# Altium project ValveBoard - Copy.PrjPcb (part 1 of 2)
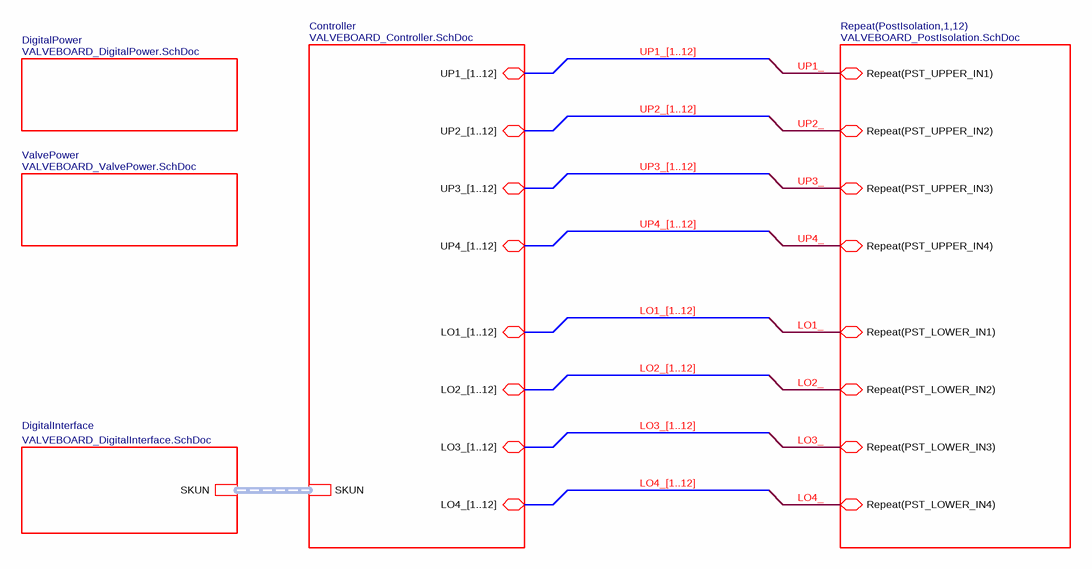
[diagram p0: VALVEBOARD_Top.SchDoc]
9 sheets, 1152 parts. Net scope: hierarchical (ports join the sheet entries above them; power ports are global).
Board file: VALVEBOARD_Kun.PcbDoc
Sheets:
  VALVEBOARD_Top.SchDoc
    PostIsolation1 = VALVEBOARD_PostIsolation.SchDoc
      Isolation = VALVEBOARD_Isolation.SchDoc
      Interface = VALVEBOARD_ValveInterface.SchDoc
      Drive1 = VALVEBOARD_ValveDrive.SchDoc
      Drive2 = VALVEBOARD_ValveDrive.SchDoc
      Drive3 = VALVEBOARD_ValveDrive.SchDoc
      Drive4 = VALVEBOARD_ValveDrive.SchDoc
    PostIsolation2 = VALVEBOARD_PostIsolation.SchDoc
      Isolation = VALVEBOARD_Isolation.SchDoc
      Interface = VALVEBOARD_ValveInterface.SchDoc
      Drive1 = VALVEBOARD_ValveDrive.SchDoc
      Drive2 = VALVEBOARD_ValveDrive.SchDoc
      Drive3 = VALVEBOARD_ValveDrive.SchDoc
      Drive4 = VALVEBOARD_ValveDrive.SchDoc
    PostIsolation3 = VALVEBOARD_PostIsolation.SchDoc
      Isolation = VALVEBOARD_Isolation.SchDoc
      Interface = VALVEBOARD_ValveInterface.SchDoc
      Drive1 = VALVEBOARD_ValveDrive.SchDoc
      Drive2 = VALVEBOARD_ValveDrive.SchDoc
      Drive3 = VALVEBOARD_ValveDrive.SchDoc
      Drive4 = VALVEBOARD_ValveDrive.SchDoc
    PostIsolation4 = VALVEBOARD_PostIsolation.SchDoc
      Isolation = VALVEBOARD_Isolation.SchDoc
      Interface = VALVEBOARD_ValveInterface.SchDoc
      Drive1 = VALVEBOARD_ValveDrive.SchDoc
      Drive2 = VALVEBOARD_ValveDrive.SchDoc
      Drive3 = VALVEBOARD_ValveDrive.SchDoc
      Drive4 = VALVEBOARD_ValveDrive.SchDoc
    PostIsolation5 = VALVEBOARD_PostIsolation.SchDoc
      Isolation = VALVEBOARD_Isolation.SchDoc
      Interface = VALVEBOARD_ValveInterface.SchDoc
      Drive1 = VALVEBOARD_ValveDrive.SchDoc
      Drive2 = VALVEBOARD_ValveDrive.SchDoc
      Drive3 = VALVEBOARD_ValveDrive.SchDoc
      Drive4 = VALVEBOARD_ValveDrive.SchDoc
    PostIsolation6 = VALVEBOARD_PostIsolation.SchDoc
      Isolation = VALVEBOARD_Isolation.SchDoc
      Interface = VALVEBOARD_ValveInterface.SchDoc
      Drive1 = VALVEBOARD_ValveDrive.SchDoc
      Drive2 = VALVEBOARD_ValveDrive.SchDoc
      Drive3 = VALVEBOARD_ValveDrive.SchDoc
      Drive4 = VALVEBOARD_ValveDrive.SchDoc
    PostIsolation7 = VALVEBOARD_PostIsolation.SchDoc
      Isolation = VALVEBOARD_Isolation.SchDoc
      Interface = VALVEBOARD_ValveInterface.SchDoc
      Drive1 = VALVEBOARD_ValveDrive.SchDoc
      Drive2 = VALVEBOARD_ValveDrive.SchDoc
      Drive3 = VALVEBOARD_ValveDrive.SchDoc
      Drive4 = VALVEBOARD_ValveDrive.SchDoc
    PostIsolation8 = VALVEBOARD_PostIsolation.SchDoc
      Isolation = VALVEBOARD_Isolation.SchDoc
      Interface = VALVEBOARD_ValveInterface.SchDoc
      Drive1 = VALVEBOARD_ValveDrive.SchDoc
      Drive2 = VALVEBOARD_ValveDrive.SchDoc
      Drive3 = VALVEBOARD_ValveDrive.SchDoc
      Drive4 = VALVEBOARD_ValveDrive.SchDoc
    PostIsolation9 = VALVEBOARD_PostIsolation.SchDoc
      Isolation = VALVEBOARD_Isolation.SchDoc
      Interface = VALVEBOARD_ValveInterface.SchDoc
      Drive1 = VALVEBOARD_ValveDrive.SchDoc
      Drive2 = VALVEBOARD_ValveDrive.SchDoc
      Drive3 = VALVEBOARD_ValveDrive.SchDoc
      Drive4 = VALVEBOARD_ValveDrive.SchDoc
    PostIsolation10 = VALVEBOARD_PostIsolation.SchDoc
      Isolation = VALVEBOARD_Isolation.SchDoc
      Interface = VALVEBOARD_ValveInterface.SchDoc
      Drive1 = VALVEBOARD_ValveDrive.SchDoc
      Drive2 = VALVEBOARD_ValveDrive.SchDoc
      Drive3 = VALVEBOARD_ValveDrive.SchDoc
      Drive4 = VALVEBOARD_ValveDrive.SchDoc
    PostIsolation11 = VALVEBOARD_PostIsolation.SchDoc
      Isolation = VALVEBOARD_Isolation.SchDoc
      Interface = VALVEBOARD_ValveInterface.SchDoc
      Drive1 = VALVEBOARD_ValveDrive.SchDoc
      Drive2 = VALVEBOARD_ValveDrive.SchDoc
      Drive3 = VALVEBOARD_ValveDrive.SchDoc
      Drive4 = VALVEBOARD_ValveDrive.SchDoc
    PostIsolation12 = VALVEBOARD_PostIsolation.SchDoc
      Isolation = VALVEBOARD_Isolation.SchDoc
      Interface = VALVEBOARD_ValveInterface.SchDoc
      Drive1 = VALVEBOARD_ValveDrive.SchDoc
      Drive2 = VALVEBOARD_ValveDrive.SchDoc
      Drive3 = VALVEBOARD_ValveDrive.SchDoc
      Drive4 = VALVEBOARD_ValveDrive.SchDoc
    Controller = VALVEBOARD_Controller.SchDoc
    DigitalInterface = VALVEBOARD_DigitalInterface.SchDoc
    DigitalPower = VALVEBOARD_DigitalPower.SchDoc
    ValvePower = VALVEBOARD_ValvePower.SchDoc

## Sheet VALVEBOARD_Top.SchDoc
size A4; SheetNumber: 1; SheetTotal: 9

### Sub-sheets
Controller = VALVEBOARD_Controller.SchDoc: UP1_[1..12] (bidir), UP2_[1..12] (bidir), UP3_[1..12] (bidir), UP4_[1..12] (bidir), LO1_[1..12] (bidir), LO2_[1..12] (bidir), LO3_[1..12] (bidir), LO4_[1..12] (bidir), SKUN
DigitalInterface = VALVEBOARD_DigitalInterface.SchDoc: SKUN (harness SKUN_TYPE)
DigitalPower = VALVEBOARD_DigitalPower.SchDoc: no entries
Repeat(PostIsolation,1,12) = VALVEBOARD_PostIsolation.SchDoc: Repeat(PST_UPPER_IN1) (bidir), Repeat(PST_UPPER_IN2) (bidir), Repeat(PST_UPPER_IN3) (bidir), Repeat(PST_UPPER_IN4) (bidir), Repeat(PST_LOWER_IN1) (bidir), Repeat(PST_LOWER_IN2) (bidir), Repeat(PST_LOWER_IN3) (bidir), Repeat(PST_LOWER_IN4) (bidir)
ValvePower = VALVEBOARD_ValvePower.SchDoc: no entries

### Buses and harness runs
bus LO1_[1..12] = sheet Controller/LO1_[1..12]
bus LO2_[1..12] = sheet Controller/LO2_[1..12]
bus LO3_[1..12] = sheet Controller/LO3_[1..12]
bus LO4_[1..12] = sheet Controller/LO4_[1..12]
bus UP1_[1..12] = sheet Controller/UP1_[1..12]
bus UP2_[1..12] = sheet Controller/UP2_[1..12]
bus UP3_[1..12] = sheet Controller/UP3_[1..12]
bus UP4_[1..12] = sheet Controller/UP4_[1..12]
harness sheet Controller/SKUN = sheet DigitalInterface/SKUN

## Sheet VALVEBOARD_PostIsolation.SchDoc
size A4; SheetNumber: 5; SheetTotal: 8
Used 12 times, as channels PostIsolation1, PostIsolation2, PostIsolation3, PostIsolation4, PostIsolation5, PostIsolation6, PostIsolation7, PostIsolation8, PostIsolation9, PostIsolation10, PostIsolation11, PostIsolation12. Parts and nets are listed once, with the designators drawn on the sheet.
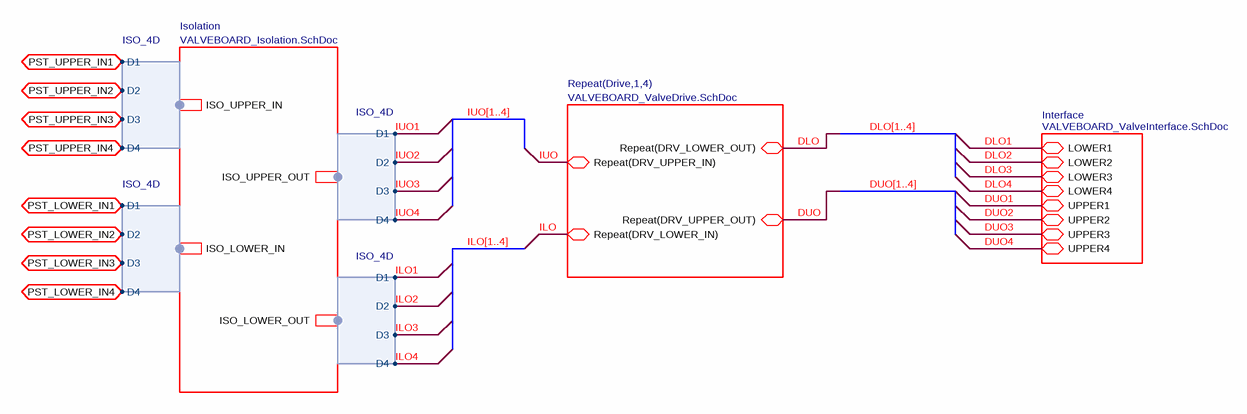
[diagram p1: VALVEBOARD_PostIsolation.SchDoc]

### Sub-sheets
Interface = VALVEBOARD_ValveInterface.SchDoc: LOWER1 (bidir), LOWER2 (bidir), LOWER3 (bidir), LOWER4 (bidir), UPPER1 (bidir), UPPER2 (bidir), UPPER3 (bidir), UPPER4 (bidir)
Isolation = VALVEBOARD_Isolation.SchDoc: ISO_UPPER_IN (harness ISO_4D), ISO_UPPER_OUT (harness ISO_4D), ISO_LOWER_IN (harness ISO_4D), ISO_LOWER_OUT (harness ISO_4D)
Repeat(Drive,1,4) = VALVEBOARD_ValveDrive.SchDoc: Repeat(DRV_UPPER_IN) (bidir), Repeat(DRV_LOWER_IN) (bidir), Repeat(DRV_UPPER_OUT) (bidir), Repeat(DRV_LOWER_OUT) (bidir)

### Ports
PST_LOWER_IN1 (bidir), PST_LOWER_IN2 (bidir), PST_LOWER_IN3 (bidir), PST_LOWER_IN4 (bidir), PST_UPPER_IN1 (bidir), PST_UPPER_IN2 (bidir), PST_UPPER_IN3 (bidir), PST_UPPER_IN4 (bidir)

### Harnesses
ISO_4D: D1, D2, D3, D4

### Nets
DLO: sheet Repeat(Drive,1,4)/Repeat(DRV_LOWER_OUT)
DLO1: sheet Interface/LOWER1
DLO2: sheet Interface/LOWER2
DLO3: sheet Interface/LOWER3
DLO4: sheet Interface/LOWER4
DUO: sheet Repeat(Drive,1,4)/Repeat(DRV_UPPER_OUT)
DUO1: sheet Interface/UPPER1
DUO2: sheet Interface/UPPER2
DUO3: sheet Interface/UPPER3
DUO4: sheet Interface/UPPER4
ILO: sheet Repeat(Drive,1,4)/Repeat(DRV_LOWER_IN)
ILO1: sheet Isolation/ISO_LOWER_OUT.D1
ILO2: sheet Isolation/ISO_LOWER_OUT.D2
ILO3: sheet Isolation/ISO_LOWER_OUT.D3
ILO4: sheet Isolation/ISO_LOWER_OUT.D4
IUO: sheet Repeat(Drive,1,4)/Repeat(DRV_UPPER_IN)
IUO1: sheet Isolation/ISO_UPPER_OUT.D1
IUO2: sheet Isolation/ISO_UPPER_OUT.D2
IUO3: sheet Isolation/ISO_UPPER_OUT.D3
IUO4: sheet Isolation/ISO_UPPER_OUT.D4
PST_LOWER_IN1: port PST_LOWER_IN1, sheet Isolation/ISO_LOWER_IN.D1
PST_LOWER_IN2: port PST_LOWER_IN2, sheet Isolation/ISO_LOWER_IN.D2
PST_LOWER_IN3: port PST_LOWER_IN3, sheet Isolation/ISO_LOWER_IN.D3
PST_LOWER_IN4: port PST_LOWER_IN4, sheet Isolation/ISO_LOWER_IN.D4
PST_UPPER_IN1: port PST_UPPER_IN1, sheet Isolation/ISO_UPPER_IN.D1
PST_UPPER_IN2: port PST_UPPER_IN2, sheet Isolation/ISO_UPPER_IN.D2
PST_UPPER_IN3: port PST_UPPER_IN3, sheet Isolation/ISO_UPPER_IN.D3
PST_UPPER_IN4: port PST_UPPER_IN4, sheet Isolation/ISO_UPPER_IN.D4

### Channels
PostIsolation1: ports PST_LOWER_IN1=LO1_1 PST_LOWER_IN2=LO2_1 PST_LOWER_IN3=LO3_1 PST_LOWER_IN4=LO4_1 PST_UPPER_IN1=UP1_1 PST_UPPER_IN2=UP2_1 PST_UPPER_IN3=UP3_1 PST_UPPER_IN4=UP4_1
PostIsolation2: ports PST_LOWER_IN1=LO1_2 PST_LOWER_IN2=LO2_2 PST_LOWER_IN3=LO3_2 PST_LOWER_IN4=LO4_2 PST_UPPER_IN1=UP1_2 PST_UPPER_IN2=UP2_2 PST_UPPER_IN3=UP3_2 PST_UPPER_IN4=UP4_2
PostIsolation3: ports PST_LOWER_IN1=LO1_3 PST_LOWER_IN2=LO2_3 PST_LOWER_IN3=LO3_3 PST_LOWER_IN4=LO4_3 PST_UPPER_IN1=UP1_3 PST_UPPER_IN2=UP2_3 PST_UPPER_IN3=UP3_3 PST_UPPER_IN4=UP4_3
PostIsolation4: ports PST_LOWER_IN1=LO1_4 PST_LOWER_IN2=LO2_4 PST_LOWER_IN3=LO3_4 PST_LOWER_IN4=LO4_4 PST_UPPER_IN1=UP1_4 PST_UPPER_IN2=UP2_4 PST_UPPER_IN3=UP3_4 PST_UPPER_IN4=UP4_4
PostIsolation5: ports PST_LOWER_IN1=LO1_5 PST_LOWER_IN2=LO2_5 PST_LOWER_IN3=LO3_5 PST_LOWER_IN4=LO4_5 PST_UPPER_IN1=UP1_5 PST_UPPER_IN2=UP2_5 PST_UPPER_IN3=UP3_5 PST_UPPER_IN4=UP4_5
PostIsolation6: ports PST_LOWER_IN1=LO1_6 PST_LOWER_IN2=LO2_6 PST_LOWER_IN3=LO3_6 PST_LOWER_IN4=LO4_6 PST_UPPER_IN1=UP1_6 PST_UPPER_IN2=UP2_6 PST_UPPER_IN3=UP3_6 PST_UPPER_IN4=UP4_6
PostIsolation7: ports PST_LOWER_IN1=LO1_7 PST_LOWER_IN2=LO2_7 PST_LOWER_IN3=LO3_7 PST_LOWER_IN4=LO4_7 PST_UPPER_IN1=UP1_7 PST_UPPER_IN2=UP2_7 PST_UPPER_IN3=UP3_7 PST_UPPER_IN4=UP4_7
PostIsolation8: ports PST_LOWER_IN1=LO1_8 PST_LOWER_IN2=LO2_8 PST_LOWER_IN3=LO3_8 PST_LOWER_IN4=LO4_8 PST_UPPER_IN1=UP1_8 PST_UPPER_IN2=UP2_8 PST_UPPER_IN3=UP3_8 PST_UPPER_IN4=UP4_8
PostIsolation9: ports PST_LOWER_IN1=LO1_9 PST_LOWER_IN2=LO2_9 PST_LOWER_IN3=LO3_9 PST_LOWER_IN4=LO4_9 PST_UPPER_IN1=UP1_9 PST_UPPER_IN2=UP2_9 PST_UPPER_IN3=UP3_9 PST_UPPER_IN4=UP4_9
PostIsolation10: ports PST_LOWER_IN1=LO1_10 PST_LOWER_IN2=LO2_10 PST_LOWER_IN3=LO3_10 PST_LOWER_IN4=LO4_10 PST_UPPER_IN1=UP1_10 PST_UPPER_IN2=UP2_10 PST_UPPER_IN3=UP3_10 PST_UPPER_IN4=UP4_10
PostIsolation11: ports PST_LOWER_IN1=LO1_11 PST_LOWER_IN2=LO2_11 PST_LOWER_IN3=LO3_11 PST_LOWER_IN4=LO4_11 PST_UPPER_IN1=UP1_11 PST_UPPER_IN2=UP2_11 PST_UPPER_IN3=UP3_11 PST_UPPER_IN4=UP4_11
PostIsolation12: ports PST_LOWER_IN1=LO1_12 PST_LOWER_IN2=LO2_12 PST_LOWER_IN3=LO3_12 PST_LOWER_IN4=LO4_12 PST_UPPER_IN1=UP1_12 PST_UPPER_IN2=UP2_12 PST_UPPER_IN3=UP3_12 PST_UPPER_IN4=UP4_12

### Buses and harness runs
bus DLO[1..4]
bus DUO[1..4]
bus ILO[1..4]
bus IUO[1..4]

## Sheet VALVEBOARD_Isolation.SchDoc
size A4; SheetNumber: 6; SheetTotal: 9
Used 12 times, as channels PostIsolation1/Isolation, PostIsolation2/Isolation, PostIsolation3/Isolation, PostIsolation4/Isolation, PostIsolation5/Isolation, PostIsolation6/Isolation, PostIsolation7/Isolation, PostIsolation8/Isolation, PostIsolation9/Isolation, PostIsolation10/Isolation, PostIsolation11/Isolation, PostIsolation12/Isolation. Parts and nets are listed once, with the designators drawn on the sheet.
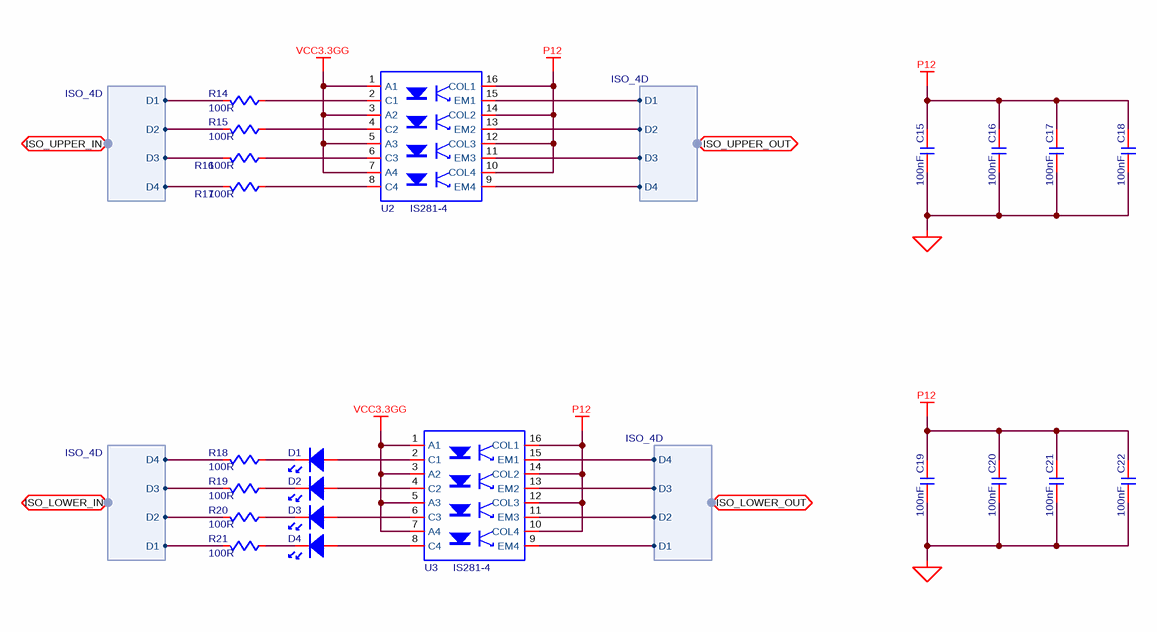
[diagram p2: VALVEBOARD_Isolation.SchDoc]

### Parts
C15  value 100nF  [C0603]  (hidden comment: C-NOMO)
C16  value 100nF  [C0603]  (hidden comment: C-NOMO)
C17  value 100nF  [C0603]  (hidden comment: C-NOMO)
C18  value 100nF  [C0603]  (hidden comment: C-NOMO)
C19  value 100nF  [C0603]  (hidden comment: C-NOMO)
C20  value 100nF  [C0603]  (hidden comment: C-NOMO)
C21  value 100nF  [C0603]  (hidden comment: C-NOMO)
C22  value 100nF  [C0603]  (hidden comment: C-NOMO)
D1  LED  [LED0603]  (value not drawn)
D2  LED  [LED0603]  (value not drawn)
D3  LED  [LED0603]  (value not drawn)
D4  LED  [LED0603]  (value not drawn)
R14  value 100R  [R0603]  (hidden comment: R)
R15  value 100R  [R0603]  (hidden comment: R)
R16  value 100R  [R0603]  (hidden comment: R)
R17  value 100R  [R0603]  (hidden comment: R)
R18  value 100R  [R0603]  (hidden comment: R)
R19  value 100R  [R0603]  (hidden comment: R)
R20  value 100R  [R0603]  (hidden comment: R)
R21  value 100R  [R0603]  (hidden comment: R)
U2  IS281-4  [PS2801]
U3  IS281-4  [PS2801]

### Ports
ISO_LOWER_IN (bidir, harness ISO_4D), ISO_LOWER_OUT (bidir, harness ISO_4D), ISO_UPPER_IN (bidir, harness ISO_4D), ISO_UPPER_OUT (bidir, harness ISO_4D)

### Harnesses
ISO_4D: D1, D2, D3, D4
ISO_4D: D4, D3, D2, D1

### Nets
P12: C15.2 C16.2 C17.2 C18.2 C19.2 C20.2 C21.2 C22.2 U2.10(COL4) U2.12(COL3) U2.14(COL2) U2.16(COL1) U3.10(COL4) U3.12(COL3) U3.14(COL2) U3.16(COL1)
PGND: C15.1 C16.1 C17.1 C18.1 C19.1 C20.1 C21.1 C22.1
VCC3.3GG: U2.1(A1) U2.3(A2) U2.5(A3) U2.7(A4) U3.1(A1) U3.3(A2) U3.5(A3) U3.7(A4)
NetD1_1: D1.1 R18.2
NetD1_2: D1.2 U3.2(C1)
NetD2_1: D2.1 R19.2
NetD2_2: D2.2 U3.4(C2)
NetD3_1: D3.1 R20.2
NetD3_2: D3.2 U3.6(C3)
NetD4_1: D4.1 R21.2
NetD4_2: D4.2 U3.8(C4)
NetR14_1: R14.1 ; port ISO_UPPER_IN.D1
NetR14_2: R14.2 U2.2(C1)
NetR15_1: R15.1 ; port ISO_UPPER_IN.D2
NetR15_2: R15.2 U2.4(C2)
NetR16_1: R16.1 ; port ISO_UPPER_IN.D3
NetR16_2: R16.2 U2.6(C3)
NetR17_1: R17.1 ; port ISO_UPPER_IN.D4
NetR17_2: R17.2 U2.8(C4)
NetR18_1: R18.1 ; port ISO_LOWER_IN.D4
NetR19_1: R19.1 ; port ISO_LOWER_IN.D3
NetR20_1: R20.1 ; port ISO_LOWER_IN.D2
NetR21_1: R21.1 ; port ISO_LOWER_IN.D1
NetU2_9: U2.9(EM4) ; port ISO_UPPER_OUT.D4
NetU2_11: U2.11(EM3) ; port ISO_UPPER_OUT.D3
NetU2_13: U2.13(EM2) ; port ISO_UPPER_OUT.D2
NetU2_15: U2.15(EM1) ; port ISO_UPPER_OUT.D1
NetU3_9: U3.9(EM4) ; port ISO_LOWER_OUT.D1
NetU3_11: U3.11(EM3) ; port ISO_LOWER_OUT.D2
NetU3_13: U3.13(EM2) ; port ISO_LOWER_OUT.D3
NetU3_15: U3.15(EM1) ; port ISO_LOWER_OUT.D4

### Channels
PostIsolation1/Isolation: designators end in _PostIsolation1_Isolation
PostIsolation2/Isolation: designators end in _PostIsolation2_Isolation
PostIsolation3/Isolation: designators end in _PostIsolation3_Isolation
PostIsolation4/Isolation: designators end in _PostIsolation4_Isolation
PostIsolation5/Isolation: designators end in _PostIsolation5_Isolation
PostIsolation6/Isolation: designators end in _PostIsolation6_Isolation
PostIsolation7/Isolation: designators end in _PostIsolation7_Isolation
PostIsolation8/Isolation: designators end in _PostIsolation8_Isolation
PostIsolation9/Isolation: designators end in _PostIsolation9_Isolation
PostIsolation10/Isolation: designators end in _PostIsolation10_Isolation
PostIsolation11/Isolation: designators end in _PostIsolation11_Isolation
PostIsolation12/Isolation: designators end in _PostIsolation12_Isolation

### Library data of the parts
C15-C22 = C-NOMO: voltage: 25V; precision: 5%
R14-R21 = R: precision: 1%
U2 U3 = PS2801

## Sheet VALVEBOARD_ValveInterface.SchDoc
size A4; SheetNumber: 7; SheetTotal: 9
Used 12 times, as channels PostIsolation1/Interface, PostIsolation2/Interface, PostIsolation3/Interface, PostIsolation4/Interface, PostIsolation5/Interface, PostIsolation6/Interface, PostIsolation7/Interface, PostIsolation8/Interface, PostIsolation9/Interface, PostIsolation10/Interface, PostIsolation11/Interface, PostIsolation12/Interface. Parts and nets are listed once, with the designators drawn on the sheet.
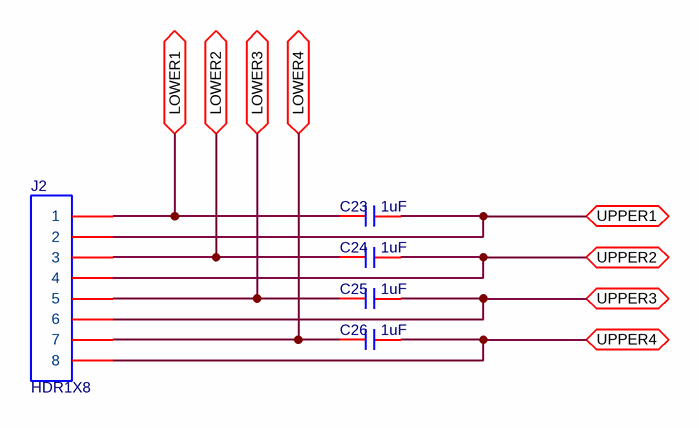
[diagram p3: VALVEBOARD_ValveInterface.SchDoc]

### Parts
C23  value 1uF  [C0805]  (hidden comment: C-NOMO)
C24  value 1uF  [C0805]  (hidden comment: C-NOMO)
C25  value 1uF  [C0805]  (hidden comment: C-NOMO)
C26  value 1uF  [C0805]  (hidden comment: C-NOMO)
J2  HDR1X8  [KF15EDGK-3.81-8P]

### Ports
LOWER1 (bidir), LOWER2 (bidir), LOWER3 (bidir), LOWER4 (bidir), UPPER1 (bidir), UPPER2 (bidir), UPPER3 (bidir), UPPER4 (bidir)

### Nets
LOWER1: C23.2 J2.1 ; port LOWER1
LOWER2: C24.2 J2.3 ; port LOWER2
LOWER3: C25.2 J2.5 ; port LOWER3
LOWER4: C26.2 J2.7 ; port LOWER4
UPPER1: C23.1 J2.2 ; port UPPER1
UPPER2: C24.1 J2.4 ; port UPPER2
UPPER3: C25.1 J2.6 ; port UPPER3
UPPER4: C26.1 J2.8 ; port UPPER4

### Channels
PostIsolation1/Interface: designators end in _PostIsolation1_Interface; ports LOWER1=DLO1_PostIsolation1 LOWER2=DLO2_PostIsolation1 LOWER3=DLO3_PostIsolation1 LOWER4=DLO4_PostIsolation1 UPPER1=DUO1_PostIsolation1 UPPER2=DUO2_PostIsolation1 UPPER3=DUO3_PostIsolation1 UPPER4=DUO4_PostIsolation1
PostIsolation2/Interface: designators end in _PostIsolation2_Interface; ports LOWER1=DLO1_PostIsolation2 LOWER2=DLO2_PostIsolation2 LOWER3=DLO3_PostIsolation2 LOWER4=DLO4_PostIsolation2 UPPER1=DUO1_PostIsolation2 UPPER2=DUO2_PostIsolation2 UPPER3=DUO3_PostIsolation2 UPPER4=DUO4_PostIsolation2
PostIsolation3/Interface: designators end in _PostIsolation3_Interface; ports LOWER1=DLO1_PostIsolation3 LOWER2=DLO2_PostIsolation3 LOWER3=DLO3_PostIsolation3 LOWER4=DLO4_PostIsolation3 UPPER1=DUO1_PostIsolation3 UPPER2=DUO2_PostIsolation3 UPPER3=DUO3_PostIsolation3 UPPER4=DUO4_PostIsolation3
PostIsolation4/Interface: designators end in _PostIsolation4_Interface; ports LOWER1=DLO1_PostIsolation4 LOWER2=DLO2_PostIsolation4 LOWER3=DLO3_PostIsolation4 LOWER4=DLO4_PostIsolation4 UPPER1=DUO1_PostIsolation4 UPPER2=DUO2_PostIsolation4 UPPER3=DUO3_PostIsolation4 UPPER4=DUO4_PostIsolation4
PostIsolation5/Interface: designators end in _PostIsolation5_Interface; ports LOWER1=DLO1_PostIsolation5 LOWER2=DLO2_PostIsolation5 LOWER3=DLO3_PostIsolation5 LOWER4=DLO4_PostIsolation5 UPPER1=DUO1_PostIsolation5 UPPER2=DUO2_PostIsolation5 UPPER3=DUO3_PostIsolation5 UPPER4=DUO4_PostIsolation5
PostIsolation6/Interface: designators end in _PostIsolation6_Interface; ports LOWER1=DLO1_PostIsolation6 LOWER2=DLO2_PostIsolation6 LOWER3=DLO3_PostIsolation6 LOWER4=DLO4_PostIsolation6 UPPER1=DUO1_PostIsolation6 UPPER2=DUO2_PostIsolation6 UPPER3=DUO3_PostIsolation6 UPPER4=DUO4_PostIsolation6
PostIsolation7/Interface: designators end in _PostIsolation7_Interface; ports LOWER1=DLO1_PostIsolation7 LOWER2=DLO2_PostIsolation7 LOWER3=DLO3_PostIsolation7 LOWER4=DLO4_PostIsolation7 UPPER1=DUO1_PostIsolation7 UPPER2=DUO2_PostIsolation7 UPPER3=DUO3_PostIsolation7 UPPER4=DUO4_PostIsolation7
PostIsolation8/Interface: designators end in _PostIsolation8_Interface; ports LOWER1=DLO1_PostIsolation8 LOWER2=DLO2_PostIsolation8 LOWER3=DLO3_PostIsolation8 LOWER4=DLO4_PostIsolation8 UPPER1=DUO1_PostIsolation8 UPPER2=DUO2_PostIsolation8 UPPER3=DUO3_PostIsolation8 UPPER4=DUO4_PostIsolation8
PostIsolation9/Interface: designators end in _PostIsolation9_Interface; ports LOWER1=DLO1_PostIsolation9 LOWER2=DLO2_PostIsolation9 LOWER3=DLO3_PostIsolation9 LOWER4=DLO4_PostIsolation9 UPPER1=DUO1_PostIsolation9 UPPER2=DUO2_PostIsolation9 UPPER3=DUO3_PostIsolation9 UPPER4=DUO4_PostIsolation9
PostIsolation10/Interface: designators end in _PostIsolation10_Interface; ports LOWER1=DLO1_PostIsolation10 LOWER2=DLO2_PostIsolation10 LOWER3=DLO3_PostIsolation10 LOWER4=DLO4_PostIsolation10 UPPER1=DUO1_PostIsolation10 UPPER2=DUO2_PostIsolation10 UPPER3=DUO3_PostIsolation10 UPPER4=DUO4_PostIsolation10
PostIsolation11/Interface: designators end in _PostIsolation11_Interface; ports LOWER1=DLO1_PostIsolation11 LOWER2=DLO2_PostIsolation11 LOWER3=DLO3_PostIsolation11 LOWER4=DLO4_PostIsolation11 UPPER1=DUO1_PostIsolation11 UPPER2=DUO2_PostIsolation11 UPPER3=DUO3_PostIsolation11 UPPER4=DUO4_PostIsolation11
PostIsolation12/Interface: designators end in _PostIsolation12_Interface; ports LOWER1=DLO1_PostIsolation12 LOWER2=DLO2_PostIsolation12 LOWER3=DLO3_PostIsolation12 LOWER4=DLO4_PostIsolation12 UPPER1=DUO1_PostIsolation12 UPPER2=DUO2_PostIsolation12 UPPER3=DUO3_PostIsolation12 UPPER4=DUO4_PostIsolation12

### Library data of the parts
C23-C26 = C-NOMO: voltage: 25V; precision: 5%

## Sheet VALVEBOARD_ValveDrive.SchDoc
size A4; SheetNumber: 8; SheetTotal: 9
Used 48 times, as channels PostIsolation1/Drive1, PostIsolation1/Drive2, PostIsolation1/Drive3, PostIsolation1/Drive4, PostIsolation2/Drive1, PostIsolation2/Drive2, PostIsolation2/Drive3, PostIsolation2/Drive4, PostIsolation3/Drive1, PostIsolation3/Drive2, PostIsolation3/Drive3, PostIsolation3/Drive4, PostIsolation4/Drive1, PostIsolation4/Drive2, PostIsolation4/Drive3, PostIsolation4/Drive4, PostIsolation5/Drive1, PostIsolation5/Drive2, PostIsolation5/Drive3, PostIsolation5/Drive4, PostIsolation6/Drive1, PostIsolation6/Drive2, PostIsolation6/Drive3, PostIsolation6/Drive4, PostIsolation7/Drive1, PostIsolation7/Drive2, PostIsolation7/Drive3, PostIsolation7/Drive4, PostIsolation8/Drive1, PostIsolation8/Drive2, PostIsolation8/Drive3, PostIsolation8/Drive4, PostIsolation9/Drive1, PostIsolation9/Drive2, PostIsolation9/Drive3, PostIsolation9/Drive4, PostIsolation10/Drive1, PostIsolation10/Drive2, PostIsolation10/Drive3, PostIsolation10/Drive4, PostIsolation11/Drive1, PostIsolation11/Drive2, PostIsolation11/Drive3, PostIsolation11/Drive4, PostIsolation12/Drive1, PostIsolation12/Drive2, PostIsolation12/Drive3, PostIsolation12/Drive4. Parts and nets are listed once, with the designators drawn on the sheet.
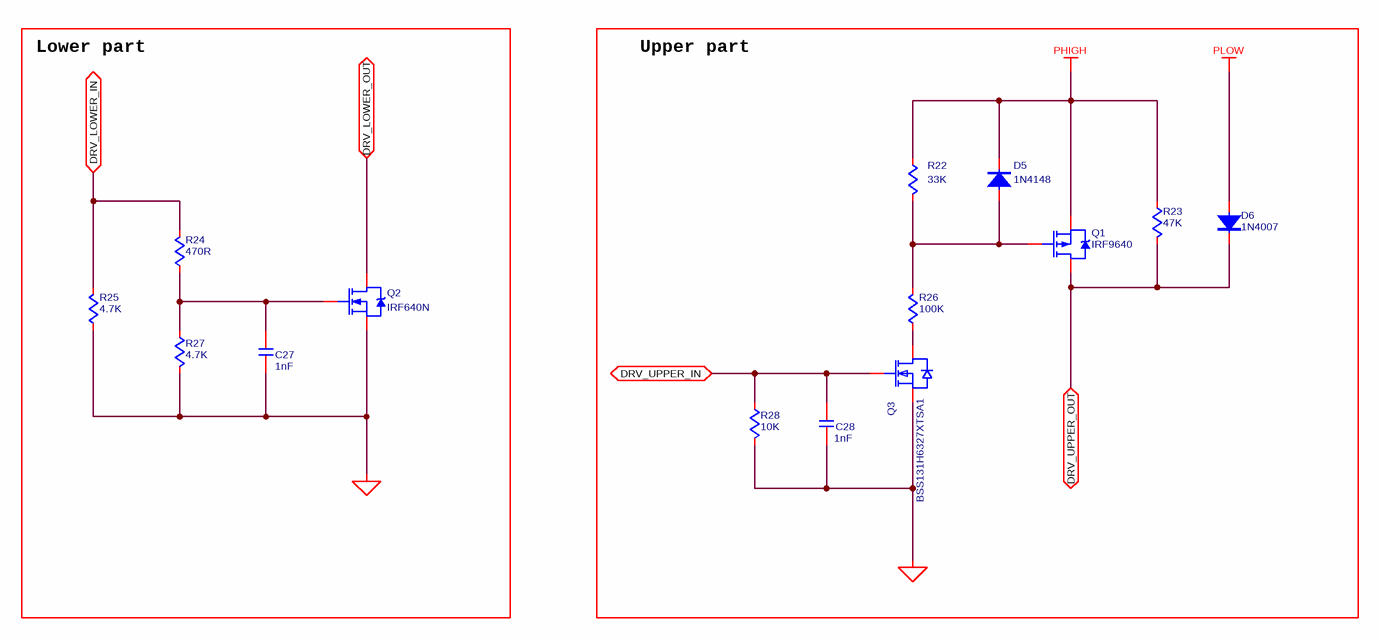
[diagram p4: VALVEBOARD_ValveDrive.SchDoc]

### Parts
C27  value 1nF  [C0603]  (hidden comment: C-NOMO)
C28  value 1nF  [C0603]  (hidden comment: C-NOMO)
D5  1N4148  [sod-123]
D6  1N4007  [1N4148]
Q1  IRF9640  [TO-220AB]
Q2  IRF640N  [TO-220AB]
Q3  BSS131H6327XTSA1  [BSS131H6327XTSA1]
R22  value 33K  [R0805]  (hidden comment: R)
R23  value 47K  [R2512]  (hidden comment: R)
R24  value 470R  [R0603]  (hidden comment: R)
R25  value 4.7K  [R0603]  (hidden comment: R)
R26  value 100K  [R0805]  (hidden comment: R)
R27  value 4.7K  [R0603]  (hidden comment: R)
R28  value 10K  [R0603]  (hidden comment: R)

### Blocks framed on the sheet
Lower part: C27 Q2 R24 R25 R27
Upper part: C28 D5 D6 Q1 Q3 R22 R23 R26 R28

### Ports
DRV_LOWER_IN (bidir), DRV_LOWER_OUT (bidir), DRV_UPPER_IN (bidir), DRV_UPPER_OUT (bidir)

### Nets
PGND: C27.1 C28.1 Q2.3(S) Q3.S R25.2 R27.1 R28.1
PHIGH: D5.1 Q1.3(S) R22.2 R23.2
PLOW: D6.2
DRV_LOWER_IN: R24.1 R25.1 ; port DRV_LOWER_IN
DRV_LOWER_OUT: Q2.2(D) ; port DRV_LOWER_OUT
DRV_UPPER_IN: C28.2 Q3.G R28.2 ; port DRV_UPPER_IN
DRV_UPPER_OUT: D6.1 Q1.2(D) R23.1 ; port DRV_UPPER_OUT
NetC27_2: C27.2 Q2.1(G) R24.2 R27.2
NetD5_2: D5.2 Q1.1(G) R22.1 R26.1
NetQ3_D: Q3.D R26.2

### Channels
PostIsolation1/Drive1: designators end in _PostIsolation1_Drive1; ports DRV_LOWER_IN=ILO1_PostIsolation1 DRV_LOWER_OUT=DLO1_PostIsolation1 DRV_UPPER_IN=IUO1_PostIsolation1 DRV_UPPER_OUT=DUO1_PostIsolation1
PostIsolation1/Drive2: designators end in _PostIsolation1_Drive2; ports DRV_LOWER_IN=ILO2_PostIsolation1 DRV_LOWER_OUT=DLO2_PostIsolation1 DRV_UPPER_IN=IUO2_PostIsolation1 DRV_UPPER_OUT=DUO2_PostIsolation1
PostIsolation1/Drive3: designators end in _PostIsolation1_Drive3; ports DRV_LOWER_IN=ILO3_PostIsolation1 DRV_LOWER_OUT=DLO3_PostIsolation1 DRV_UPPER_IN=IUO3_PostIsolation1 DRV_UPPER_OUT=DUO3_PostIsolation1
PostIsolation1/Drive4: designators end in _PostIsolation1_Drive4; ports DRV_LOWER_IN=ILO4_PostIsolation1 DRV_LOWER_OUT=DLO4_PostIsolation1 DRV_UPPER_IN=IUO4_PostIsolation1 DRV_UPPER_OUT=DUO4_PostIsolation1
PostIsolation2/Drive1: designators end in _PostIsolation2_Drive1; ports DRV_LOWER_IN=ILO1_PostIsolation2 DRV_LOWER_OUT=DLO1_PostIsolation2 DRV_UPPER_IN=IUO1_PostIsolation2 DRV_UPPER_OUT=DUO1_PostIsolation2
PostIsolation2/Drive2: designators end in _PostIsolation2_Drive2; ports DRV_LOWER_IN=ILO2_PostIsolation2 DRV_LOWER_OUT=DLO2_PostIsolation2 DRV_UPPER_IN=IUO2_PostIsolation2 DRV_UPPER_OUT=DUO2_PostIsolation2
PostIsolation2/Drive3: designators end in _PostIsolation2_Drive3; ports DRV_LOWER_IN=ILO3_PostIsolation2 DRV_LOWER_OUT=DLO3_PostIsolation2 DRV_UPPER_IN=IUO3_PostIsolation2 DRV_UPPER_OUT=DUO3_PostIsolation2
PostIsolation2/Drive4: designators end in _PostIsolation2_Drive4; ports DRV_LOWER_IN=ILO4_PostIsolation2 DRV_LOWER_OUT=DLO4_PostIsolation2 DRV_UPPER_IN=IUO4_PostIsolation2 DRV_UPPER_OUT=DUO4_PostIsolation2
PostIsolation3/Drive1: designators end in _PostIsolation3_Drive1; ports DRV_LOWER_IN=ILO1_PostIsolation3 DRV_LOWER_OUT=DLO1_PostIsolation3 DRV_UPPER_IN=IUO1_PostIsolation3 DRV_UPPER_OUT=DUO1_PostIsolation3
PostIsolation3/Drive2: designators end in _PostIsolation3_Drive2; ports DRV_LOWER_IN=ILO2_PostIsolation3 DRV_LOWER_OUT=DLO2_PostIsolation3 DRV_UPPER_IN=IUO2_PostIsolation3 DRV_UPPER_OUT=DUO2_PostIsolation3
PostIsolation3/Drive3: designators end in _PostIsolation3_Drive3; ports DRV_LOWER_IN=ILO3_PostIsolation3 DRV_LOWER_OUT=DLO3_PostIsolation3 DRV_UPPER_IN=IUO3_PostIsolation3 DRV_UPPER_OUT=DUO3_PostIsolation3
PostIsolation3/Drive4: designators end in _PostIsolation3_Drive4; ports DRV_LOWER_IN=ILO4_PostIsolation3 DRV_LOWER_OUT=DLO4_PostIsolation3 DRV_UPPER_IN=IUO4_PostIsolation3 DRV_UPPER_OUT=DUO4_PostIsolation3
PostIsolation4/Drive1: designators end in _PostIsolation4_Drive1; ports DRV_LOWER_IN=ILO1_PostIsolation4 DRV_LOWER_OUT=DLO1_PostIsolation4 DRV_UPPER_IN=IUO1_PostIsolation4 DRV_UPPER_OUT=DUO1_PostIsolation4
PostIsolation4/Drive2: designators end in _PostIsolation4_Drive2; ports DRV_LOWER_IN=ILO2_PostIsolation4 DRV_LOWER_OUT=DLO2_PostIsolation4 DRV_UPPER_IN=IUO2_PostIsolation4 DRV_UPPER_OUT=DUO2_PostIsolation4
PostIsolation4/Drive3: designators end in _PostIsolation4_Drive3; ports DRV_LOWER_IN=ILO3_PostIsolation4 DRV_LOWER_OUT=DLO3_PostIsolation4 DRV_UPPER_IN=IUO3_PostIsolation4 DRV_UPPER_OUT=DUO3_PostIsolation4
PostIsolation4/Drive4: designators end in _PostIsolation4_Drive4; ports DRV_LOWER_IN=ILO4_PostIsolation4 DRV_LOWER_OUT=DLO4_PostIsolation4 DRV_UPPER_IN=IUO4_PostIsolation4 DRV_UPPER_OUT=DUO4_PostIsolation4
PostIsolation5/Drive1: designators end in _PostIsolation5_Drive1; ports DRV_LOWER_IN=ILO1_PostIsolation5 DRV_LOWER_OUT=DLO1_PostIsolation5 DRV_UPPER_IN=IUO1_PostIsolation5 DRV_UPPER_OUT=DUO1_PostIsolation5
PostIsolation5/Drive2: designators end in _PostIsolation5_Drive2; ports DRV_LOWER_IN=ILO2_PostIsolation5 DRV_LOWER_OUT=DLO2_PostIsolation5 DRV_UPPER_IN=IUO2_PostIsolation5 DRV_UPPER_OUT=DUO2_PostIsolation5
PostIsolation5/Drive3: designators end in _PostIsolation5_Drive3; ports DRV_LOWER_IN=ILO3_PostIsolation5 DRV_LOWER_OUT=DLO3_PostIsolation5 DRV_UPPER_IN=IUO3_PostIsolation5 DRV_UPPER_OUT=DUO3_PostIsolation5
PostIsolation5/Drive4: designators end in _PostIsolation5_Drive4; ports DRV_LOWER_IN=ILO4_PostIsolation5 DRV_LOWER_OUT=DLO4_PostIsolation5 DRV_UPPER_IN=IUO4_PostIsolation5 DRV_UPPER_OUT=DUO4_PostIsolation5
PostIsolation6/Drive1: designators end in _PostIsolation6_Drive1; ports DRV_LOWER_IN=ILO1_PostIsolation6 DRV_LOWER_OUT=DLO1_PostIsolation6 DRV_UPPER_IN=IUO1_PostIsolation6 DRV_UPPER_OUT=DUO1_PostIsolation6
PostIsolation6/Drive2: designators end in _PostIsolation6_Drive2; ports DRV_LOWER_IN=ILO2_PostIsolation6 DRV_LOWER_OUT=DLO2_PostIsolation6 DRV_UPPER_IN=IUO2_PostIsolation6 DRV_UPPER_OUT=DUO2_PostIsolation6
PostIsolation6/Drive3: designators end in _PostIsolation6_Drive3; ports DRV_LOWER_IN=ILO3_PostIsolation6 DRV_LOWER_OUT=DLO3_PostIsolation6 DRV_UPPER_IN=IUO3_PostIsolation6 DRV_UPPER_OUT=DUO3_PostIsolation6
PostIsolation6/Drive4: designators end in _PostIsolation6_Drive4; ports DRV_LOWER_IN=ILO4_PostIsolation6 DRV_LOWER_OUT=DLO4_PostIsolation6 DRV_UPPER_IN=IUO4_PostIsolation6 DRV_UPPER_OUT=DUO4_PostIsolation6
PostIsolation7/Drive1: designators end in _PostIsolation7_Drive1; ports DRV_LOWER_IN=ILO1_PostIsolation7 DRV_LOWER_OUT=DLO1_PostIsolation7 DRV_UPPER_IN=IUO1_PostIsolation7 DRV_UPPER_OUT=DUO1_PostIsolation7
PostIsolation7/Drive2: designators end in _PostIsolation7_Drive2; ports DRV_LOWER_IN=ILO2_PostIsolation7 DRV_LOWER_OUT=DLO2_PostIsolation7 DRV_UPPER_IN=IUO2_PostIsolation7 DRV_UPPER_OUT=DUO2_PostIsolation7
PostIsolation7/Drive3: designators end in _PostIsolation7_Drive3; ports DRV_LOWER_IN=ILO3_PostIsolation7 DRV_LOWER_OUT=DLO3_PostIsolation7 DRV_UPPER_IN=IUO3_PostIsolation7 DRV_UPPER_OUT=DUO3_PostIsolation7
PostIsolation7/Drive4: designators end in _PostIsolation7_Drive4; ports DRV_LOWER_IN=ILO4_PostIsolation7 DRV_LOWER_OUT=DLO4_PostIsolation7 DRV_UPPER_IN=IUO4_PostIsolation7 DRV_UPPER_OUT=DUO4_PostIsolation7
PostIsolation8/Drive1: designators end in _PostIsolation8_Drive1; ports DRV_LOWER_IN=ILO1_PostIsolation8 DRV_LOWER_OUT=DLO1_PostIsolation8 DRV_UPPER_IN=IUO1_PostIsolation8 DRV_UPPER_OUT=DUO1_PostIsolation8
PostIsolation8/Drive2: designators end in _PostIsolation8_Drive2; ports DRV_LOWER_IN=ILO2_PostIsolation8 DRV_LOWER_OUT=DLO2_PostIsolation8 DRV_UPPER_IN=IUO2_PostIsolation8 DRV_UPPER_OUT=DUO2_PostIsolation8
PostIsolation8/Drive3: designators end in _PostIsolation8_Drive3; ports DRV_LOWER_IN=ILO3_PostIsolation8 DRV_LOWER_OUT=DLO3_PostIsolation8 DRV_UPPER_IN=IUO3_PostIsolation8 DRV_UPPER_OUT=DUO3_PostIsolation8
PostIsolation8/Drive4: designators end in _PostIsolation8_Drive4; ports DRV_LOWER_IN=ILO4_PostIsolation8 DRV_LOWER_OUT=DLO4_PostIsolation8 DRV_UPPER_IN=IUO4_PostIsolation8 DRV_UPPER_OUT=DUO4_PostIsolation8
PostIsolation9/Drive1: designators end in _PostIsolation9_Drive1; ports DRV_LOWER_IN=ILO1_PostIsolation9 DRV_LOWER_OUT=DLO1_PostIsolation9 DRV_UPPER_IN=IUO1_PostIsolation9 DRV_UPPER_OUT=DUO1_PostIsolation9
PostIsolation9/Drive2: designators end in _PostIsolation9_Drive2; ports DRV_LOWER_IN=ILO2_PostIsolation9 DRV_LOWER_OUT=DLO2_PostIsolation9 DRV_UPPER_IN=IUO2_PostIsolation9 DRV_UPPER_OUT=DUO2_PostIsolation9
PostIsolation9/Drive3: designators end in _PostIsolation9_Drive3; ports DRV_LOWER_IN=ILO3_PostIsolation9 DRV_LOWER_OUT=DLO3_PostIsolation9 DRV_UPPER_IN=IUO3_PostIsolation9 DRV_UPPER_OUT=DUO3_PostIsolation9
PostIsolation9/Drive4: designators end in _PostIsolation9_Drive4; ports DRV_LOWER_IN=ILO4_PostIsolation9 DRV_LOWER_OUT=DLO4_PostIsolation9 DRV_UPPER_IN=IUO4_PostIsolation9 DRV_UPPER_OUT=DUO4_PostIsolation9
PostIsolation10/Drive1: designators end in _PostIsolation10_Drive1; ports DRV_LOWER_IN=ILO1_PostIsolation10 DRV_LOWER_OUT=DLO1_PostIsolation10 DRV_UPPER_IN=IUO1_PostIsolation10 DRV_UPPER_OUT=DUO1_PostIsolation10
PostIsolation10/Drive2: designators end in _PostIsolation10_Drive2; ports DRV_LOWER_IN=ILO2_PostIsolation10 DRV_LOWER_OUT=DLO2_PostIsolation10 DRV_UPPER_IN=IUO2_PostIsolation10 DRV_UPPER_OUT=DUO2_PostIsolation10
PostIsolation10/Drive3: designators end in _PostIsolation10_Drive3; ports DRV_LOWER_IN=ILO3_PostIsolation10 DRV_LOWER_OUT=DLO3_PostIsolation10 DRV_UPPER_IN=IUO3_PostIsolation10 DRV_UPPER_OUT=DUO3_PostIsolation10
PostIsolation10/Drive4: designators end in _PostIsolation10_Drive4; ports DRV_LOWER_IN=ILO4_PostIsolation10 DRV_LOWER_OUT=DLO4_PostIsolation10 DRV_UPPER_IN=IUO4_PostIsolation10 DRV_UPPER_OUT=DUO4_PostIsolation10
PostIsolation11/Drive1: designators end in _PostIsolation11_Drive1; ports DRV_LOWER_IN=ILO1_PostIsolation11 DRV_LOWER_OUT=DLO1_PostIsolation11 DRV_UPPER_IN=IUO1_PostIsolation11 DRV_UPPER_OUT=DUO1_PostIsolation11
PostIsolation11/Drive2: designators end in _PostIsolation11_Drive2; ports DRV_LOWER_IN=ILO2_PostIsolation11 DRV_LOWER_OUT=DLO2_PostIsolation11 DRV_UPPER_IN=IUO2_PostIsolation11 DRV_UPPER_OUT=DUO2_PostIsolation11
PostIsolation11/Drive3: designators end in _PostIsolation11_Drive3; ports DRV_LOWER_IN=ILO3_PostIsolation11 DRV_LOWER_OUT=DLO3_PostIsolation11 DRV_UPPER_IN=IUO3_PostIsolation11 DRV_UPPER_OUT=DUO3_PostIsolation11
PostIsolation11/Drive4: designators end in _PostIsolation11_Drive4; ports DRV_LOWER_IN=ILO4_PostIsolation11 DRV_LOWER_OUT=DLO4_PostIsolation11 DRV_UPPER_IN=IUO4_PostIsolation11 DRV_UPPER_OUT=DUO4_PostIsolation11
PostIsolation12/Drive1: designators end in _PostIsolation12_Drive1; ports DRV_LOWER_IN=ILO1_PostIsolation12 DRV_LOWER_OUT=DLO1_PostIsolation12 DRV_UPPER_IN=IUO1_PostIsolation12 DRV_UPPER_OUT=DUO1_PostIsolation12
PostIsolation12/Drive2: designators end in _PostIsolation12_Drive2; ports DRV_LOWER_IN=ILO2_PostIsolation12 DRV_LOWER_OUT=DLO2_PostIsolation12 DRV_UPPER_IN=IUO2_PostIsolation12 DRV_UPPER_OUT=DUO2_PostIsolation12
PostIsolation12/Drive3: designators end in _PostIsolation12_Drive3; ports DRV_LOWER_IN=ILO3_PostIsolation12 DRV_LOWER_OUT=DLO3_PostIsolation12 DRV_UPPER_IN=IUO3_PostIsolation12 DRV_UPPER_OUT=DUO3_PostIsolation12
PostIsolation12/Drive4: designators end in _PostIsolation12_Drive4; ports DRV_LOWER_IN=ILO4_PostIsolation12 DRV_LOWER_OUT=DLO4_PostIsolation12 DRV_UPPER_IN=IUO4_PostIsolation12 DRV_UPPER_OUT=DUO4_PostIsolation12

### Library data of the parts
C27 C28 = C-NOMO: voltage: 25V; precision: 5%
D5 D6 = DIOD1
Q1 = IRF9640: P-Channel Power MOSFET; Note: Pin 4 not drawn and electrically connected to Pin 2.; Published: 8-Jun-2000; LatestRevisionDate: 17-Jul-2002; LatestRevisionNote: Re-released for DXP Platform.; DatasheetVersion: PD-9.390D; PackageVersion: Feb-1997; PackageReference: TO-220AB; Publisher: Altium Limited; PackageDescription: TO, Thru-Hole, Vertical, Heatsink Mounted; 3 In-Line Leads; Pitch 2.54 mm; ComponentLink1Description: Manufacturer Link; ComponentLink1URL: http://www.irf.com/
Q2 = IRF640N: N-Channel Power MOSFET; Note: Pin 2 is electrically connected to pin 4.; Published: 8-Jun-2000; LatestRevisionDate: 17-Jul-2002; LatestRevisionNote: Re-released for DXP Platform.; DatasheetVersion: PD-9.814; PackageVersion: Feb-1997; PackageReference: TO-220AB; Publisher: Altium Limited; PackageDescription: TO, Thru-Hole, Vertical, Heatsink Mounted; 3 In-Line Leads; Pitch 2.54 mm; ComponentLink1Description: Manufacturer Link; ComponentLink1URL: http://www.irf.com/
R22-R28 = R: precision: 1%
Q3 = BSS131H6327XTSA1: Supplier 1: LCSC; Supplier Part Number 1: C151498

## Sheet VALVEBOARD_Controller.SchDoc
size A3; SheetNumber: 2; SheetTotal: 9
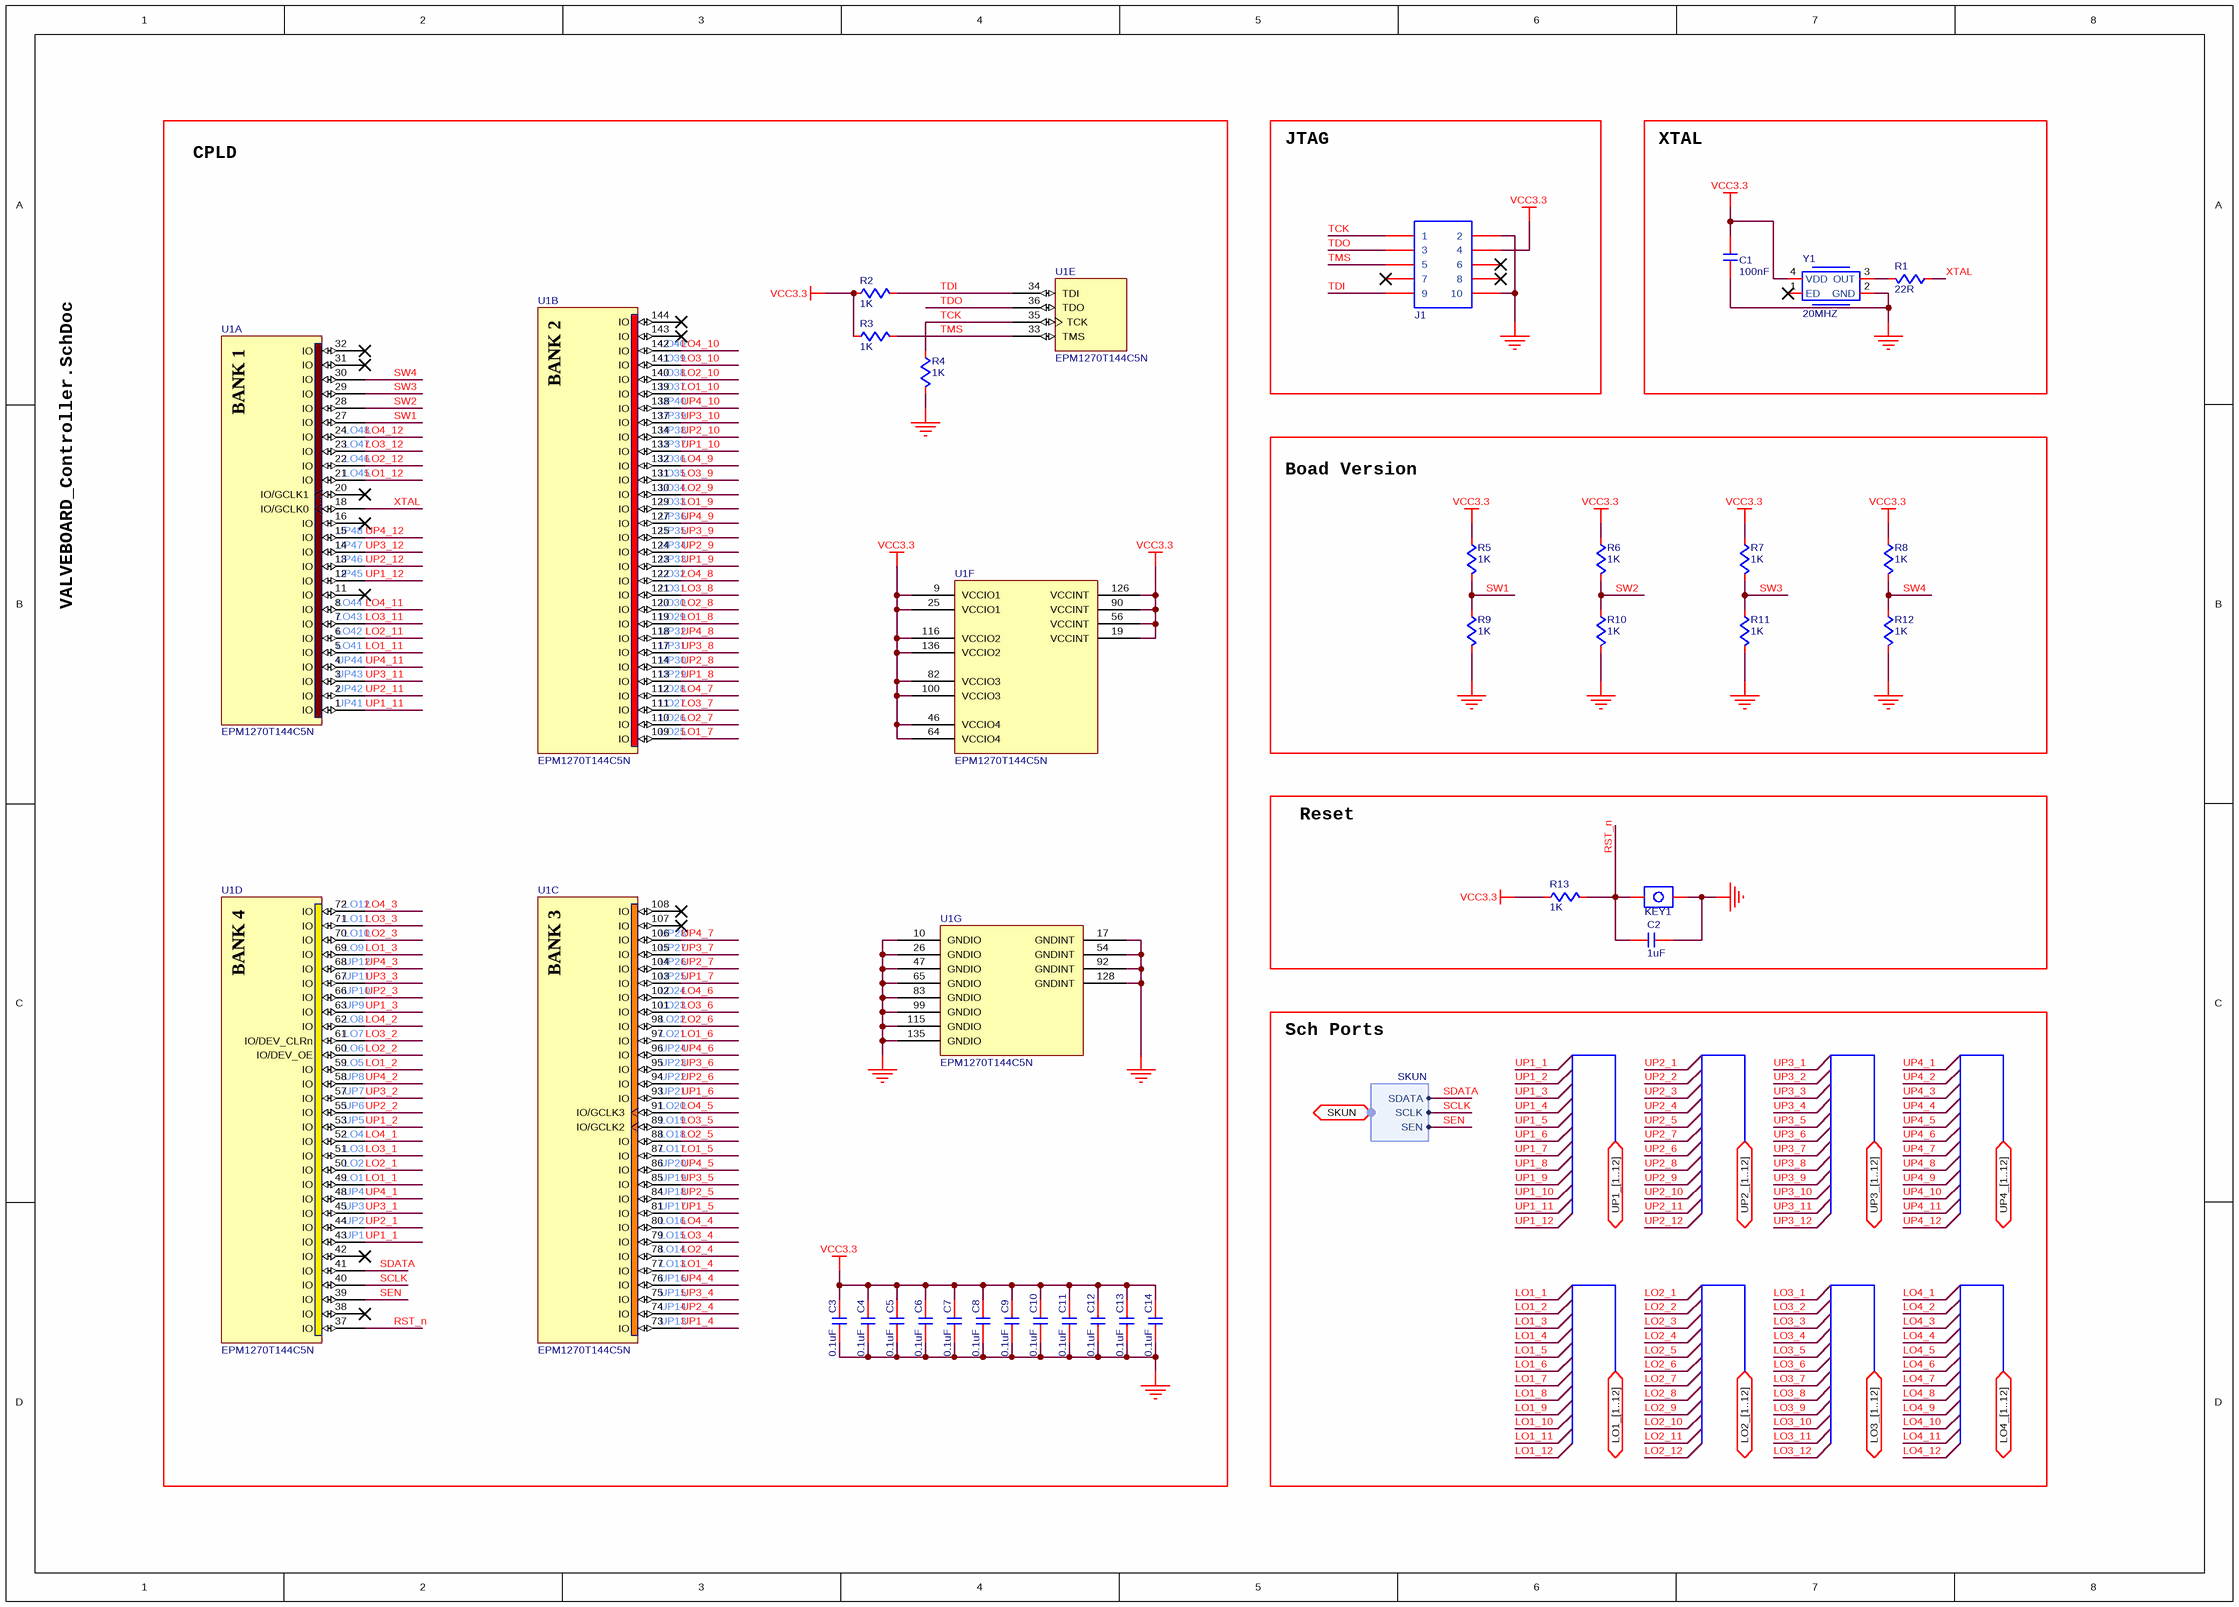
[diagram p5: VALVEBOARD_Controller.SchDoc]

### Parts
C1  value 100nF  [C0402]  (hidden comment: C-NOMO)
C2  value 1uF  [C0402]  (hidden comment: C-NOMO)
C3  value 0.1uF  [C0402]  (hidden comment: C-NOMO)
C4  value 0.1uF  [C0402]  (hidden comment: C-NOMO)
C5  value 0.1uF  [C0402]  (hidden comment: C-NOMO)
C6  value 0.1uF  [C0402]  (hidden comment: C-NOMO)
C7  value 0.1uF  [C0402]  (hidden comment: C-NOMO)
C8  value 0.1uF  [C0402]  (hidden comment: C-NOMO)
C9  value 0.1uF  [C0402]  (hidden comment: C-NOMO)
C10  value 0.1uF  [C0402]  (hidden comment: C-NOMO)
C11  value 0.1uF  [C0402]  (hidden comment: C-NOMO)
C12  value 0.1uF  [C0402]  (hidden comment: C-NOMO)
C13  value 0.1uF  [C0402]  (hidden comment: C-NOMO)
C14  value 0.1uF  [C0402]  (hidden comment: C-NOMO)
J1  HDR2X5  [HDR2X5-NJ]  (value not drawn)
KEY1  KEY  [KEY735SO]  (value not drawn)
R1  value 22R  [R0402]  (hidden comment: R)
R2  value 1K  [R0402]  (hidden comment: R)
R3  value 1K  [R0402]  (hidden comment: R)
R4  value 1K  [R0402]  (hidden comment: R)
R5  value 1K  [R0402]  (hidden comment: R)
R6  value 1K  [R0402]  (hidden comment: R)
R7  value 1K  [R0402]  (hidden comment: R)
R8  value 1K  [R0402]  (hidden comment: R)
R9  value 1K  [R0402]  (hidden comment: R)
R10  value 1K  [R0402]  (hidden comment: R)
R11  value 1K  [R0402]  (hidden comment: R)
R12  value 1K  [R0402]  (hidden comment: R)
R13  value 1K  [R0402]  (hidden comment: R)
U1  EPM1270T144C5N  [TQFP144_N]  (parts A,B,C,D,E,F,G of 7)
Y1  frequency: 20MHZ  [OSC3225]  (hidden comment: XTAL)

### Blocks framed on the sheet
CPLD: C3-C14 R2-R4 U1
JTAG: J1
XTAL: C1 R1 Y1
Boad Version: R5-R12
Reset: C2 KEY1 R13

### Ports
LO1_[1..12] (bidir), LO2_[1..12] (bidir), LO3_[1..12] (bidir), LO4_[1..12] (bidir), SKUN (bidir, harness SKUN), UP1_[1..12] (bidir), UP2_[1..12] (bidir), UP3_[1..12] (bidir), UP4_[1..12] (bidir)

### Harnesses
SKUN: SDATA, SCLK, SEN

### Nets
DGND: C1.1 C2.1 C3.1 C4.1 C5.1 C6.1 C7.1 C8.1 C9.1 C10.1 C11.1 C12.1 C13.1 C14.1 J1.2 J1.10 KEY1.1 R4.1 R9.1 R10.1 R11.1 R12.1 U1.10(GNDIO) U1.17(GNDINT) U1.26(GNDIO) U1.47(GNDIO) U1.54(GNDINT) U1.65(GNDIO) U1.83(GNDIO) U1.92(GNDINT) U1.99(GNDIO) U1.115(GNDIO) U1.128(GNDINT) U1.135(GNDIO) Y1.2(GND)
VCC3.3: C1.2 C3.2 C4.2 C5.2 C6.2 C7.2 C8.2 C9.2 C10.2 C11.2 C12.2 C13.2 C14.2 J1.4 R2.2 R3.2 R5.2 R6.2 R7.2 R8.2 R13.2 U1.9(VCCIO1) U1.19(VCCINT) U1.25(VCCIO1) U1.46(VCCIO4) U1.56(VCCINT) U1.64(VCCIO4) U1.82(VCCIO3) U1.90(VCCINT) U1.100(VCCIO3) U1.116(VCCIO2) U1.126(VCCINT) U1.136(VCCIO2) Y1.4(VDD)
LO1_1: U1.49(IO)
LO1_2: U1.59(IO)
LO1_3: U1.69(IO)
LO1_4: U1.77(IO)
LO1_5: U1.87(IO)
LO1_6: U1.97(IO)
LO1_7: U1.109(IO)
LO1_8: U1.119(IO)
LO1_9: U1.129(IO)
LO1_10: U1.139(IO)
LO1_11: U1.5(IO)
LO1_12: U1.21(IO)
LO2_1: U1.50(IO)
LO2_2: U1.60(IO/DEV_OE)
LO2_3: U1.70(IO)
LO2_4: U1.78(IO)
LO2_5: U1.88(IO)
LO2_6: U1.98(IO)
LO2_7: U1.110(IO)
LO2_8: U1.120(IO)
LO2_9: U1.130(IO)
LO2_10: U1.140(IO)
LO2_11: U1.6(IO)
LO2_12: U1.22(IO)
LO3_1: U1.51(IO)
LO3_2: U1.61(IO/DEV_CLRn)
LO3_3: U1.71(IO)
LO3_4: U1.79(IO)
LO3_5: U1.89(IO/GCLK2)
LO3_6: U1.101(IO)
LO3_7: U1.111(IO)
LO3_8: U1.121(IO)
LO3_9: U1.131(IO)
LO3_10: U1.141(IO)
LO3_11: U1.7(IO)
LO3_12: U1.23(IO)
LO4_1: U1.52(IO)
LO4_2: U1.62(IO)
LO4_3: U1.72(IO)
LO4_4: U1.80(IO)
LO4_5: U1.91(IO/GCLK3)
LO4_6: U1.102(IO)
LO4_7: U1.112(IO)
LO4_8: U1.122(IO)
LO4_9: U1.132(IO)
LO4_10: U1.142(IO)
LO4_11: U1.8(IO)
LO4_12: U1.24(IO)
RST_n: C2.2 KEY1.2 R13.1 U1.37(IO)
SCLK: U1.40(IO) ; port SKUN.SCLK
SDATA: U1.41(IO) ; port SKUN.SDATA
SEN: U1.39(IO) ; port SKUN.SEN
SW1: R5.1 R9.2 U1.27(IO)
SW2: R6.1 R10.2 U1.28(IO)
SW3: R7.1 R11.2 U1.29(IO)
SW4: R8.1 R12.2 U1.30(IO)
TCK: J1.1 R4.2 U1.35(TCK)
TDI: J1.9 R2.1 U1.34(TDI)
TDO: J1.3 U1.36(TDO)
TMS: J1.5 R3.1 U1.33(TMS)
UP1_1: U1.43(IO)
UP1_2: U1.53(IO)
UP1_3: U1.63(IO)
UP1_4: U1.73(IO)
UP1_5: U1.81(IO)
UP1_6: U1.93(IO)
UP1_7: U1.103(IO)
UP1_8: U1.113(IO)
UP1_9: U1.123(IO)
UP1_10: U1.133(IO)
UP1_11: U1.1(IO)
UP1_12: U1.12(IO)
UP2_1: U1.44(IO)
UP2_2: U1.55(IO)
UP2_3: U1.66(IO)
UP2_4: U1.74(IO)
UP2_5: U1.84(IO)
UP2_6: U1.94(IO)
UP2_7: U1.104(IO)
UP2_8: U1.114(IO)
UP2_9: U1.124(IO)
UP2_10: U1.134(IO)
UP2_11: U1.2(IO)
UP2_12: U1.13(IO)
UP3_1: U1.45(IO)
UP3_2: U1.57(IO)
UP3_3: U1.67(IO)
UP3_4: U1.75(IO)
UP3_5: U1.85(IO)
UP3_6: U1.95(IO)
UP3_7: U1.105(IO)
UP3_8: U1.117(IO)
UP3_9: U1.125(IO)
UP3_10: U1.137(IO)
UP3_11: U1.3(IO)
UP3_12: U1.14(IO)
UP4_1: U1.48(IO)
UP4_2: U1.58(IO)
UP4_3: U1.68(IO)
UP4_4: U1.76(IO)
UP4_5: U1.86(IO)
UP4_6: U1.96(IO)
UP4_7: U1.106(IO)
UP4_8: U1.118(IO)
UP4_9: U1.127(IO)
UP4_10: U1.138(IO)
UP4_11: U1.4(IO)
UP4_12: U1.15(IO)
XTAL: R1.2 U1.18(IO/GCLK0)
NetR1_1: R1.1 Y1.3(OUT)

Not connected (* = marked no-connect by the designer): J1 6* 7* 8*; U1 11(IO)* 16(IO)* 20(IO/GCLK1)* 31(IO)* 32(IO)* 38(IO)* 42(IO)* 107(IO)* 108(IO)* 143(IO)* 144(IO)*; Y1 1(ED)*

### Notes on the sheet
- (near U1) UP40
- (near U1) LO37
- (near U1) LO38
- (near U1) LO39
- (near U1) LO40
- (near U1) LO45
- (near U1) LO46
- (near U1) LO47
- (near U1) LO48
- (near U1) UP37
- (near U1) UP38
- (near U1) UP39
- (near U1) LO35
- (near U1) LO36
- (near U1) UP47
- (near U1) UP48
- (near U1) UP34
- (near U1) UP35
- (near U1) UP36
- (near U1) LO33
- (near U1) LO34
- (near U1) UP45
- (near U1) UP46
- (near U1) LO43
- (near U1) LO44
- (near U1) UP33
- (near U1) LO29
- (near U1) LO30
- (near U1) LO31
- (near U1) LO32
- (near U1) UP42
- (near U1) UP43
- (near U1) UP44
- (near U1) LO41
- (near U1) LO42
- (near U1) UP29
- (near U1) UP30
- (near U1) UP31
- (near U1) UP32
- (near U1) LO28
- (near U1) UP41
- (near U1) LO25
- (near U1) LO26
- (near U1) LO27
- (near U1) LO12
- (near U1) UP11
- (near U1) UP12
- (near U1) LO9
- (near U1) LO10
- (near U1) LO11
- (near U1) UP25
- (near U1) UP26
- (near U1) UP27
- (near U1) UP28
- (near U1) UP9
- (near U1) UP10
- (near U1) LO6
- (near U1) LO7
- (near U1) LO8
- (near U1) UP24
- (near U1) LO21
- (near U1) LO22
- (near U1) LO23
- (near U1) LO24
- Sch Ports
- (near U1) UP5
- (near U1) UP6
- (near U1) UP7
- (near U1) UP8
- (near U1) LO5
- (near U1) UP21
- (near U1) UP22
- (near U1) UP23
- (near U1) LO19
- (near U1) LO20
- (near U1) UP4
- (near U1) LO1
- (near U1) LO2
- (near U1) LO3
- (near U1) LO4
- (near U1) UP18
- (near U1) UP19
- (near U1) UP20
- (near U1) LO17
- (near U1) LO18
- (near U1) UP1
- (near U1) UP2
- (near U1) UP3
- (near U1) UP17
- (near U1) LO13
- (near U1) LO14
- (near U1) LO15
- (near U1) LO16
- (near U1) UP13
- (near U1) UP14
- (near U1) UP15
- (near U1) UP16
- (in symbol EPM1270T144C5N, part A) BANK 1
- (in symbol EPM1270T144C5N, part B) BANK 2
- (in symbol EPM1270T144C5N, part C) BANK 3
- (in symbol EPM1270T144C5N, part D) BANK 4

### Library data of the parts
C1-C14 = C-NOMO: voltage: 25V; precision: 5%
R1-R13 = R: precision: 1%
U1 = EPM1270T144C5N: MAX II 3.3/2.5V CPLD, 116 IOs, 1,270 Logic Elements, 144-Pin Plastic TQFP, Commercial Temperature, Speed Grade 5, Pb-Free; Note: All VCCINT pins must be connected to either 3.3V or 2.5V (but not a combination of both).; DatasheetVersion: ver1.8, Jul-2006; PackageVersion: ver16.3, Dec-2010; PackageReference: TQFP144; PackageDescription: 144-Pin Plastic Thin Quad Flat Pack (TQFP144) - Wire Bond; Code_JEDEC: MS-026-BFB; ComponentLink1Description: Manufacturer URL; ComponentLink1URL: http://www.altera.com/; ComponentLink2Description: Handbook; ComponentLink2URL: http://www.altera.com/literature/hb/max2/max2_mii5v1.pdf; ComponentLink3Description: Package Specification; ComponentLink3URL: http://www.altera.com/literature/ds/dspkg.pdf

## Sheet VALVEBOARD_DigitalInterface.SchDoc
size A4; SheetNumber: 9; SheetTotal: 9
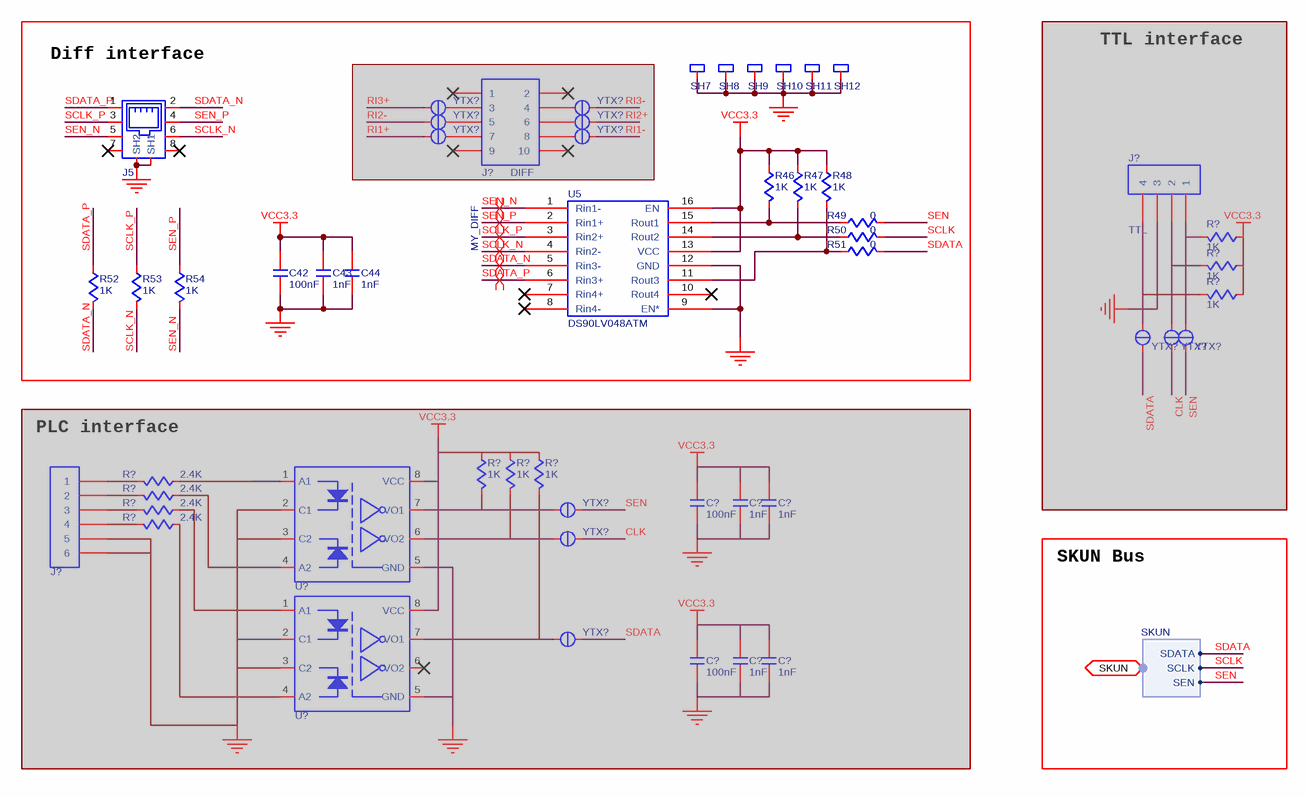
[diagram p6: VALVEBOARD_DigitalInterface.SchDoc]

### Parts
(Parts that share a designator on the sheet are numbered #1, #2 ... from top to bottom, then left to right.)
C42  value 100nF  [C0402]  (hidden comment: C-NOMO)
C43  value 1nF  [C0402]  (hidden comment: C-NOMO)
C44  value 1nF  [C0402]  (hidden comment: C-NOMO)
C?#1  value 100nF  [C0402]  (hidden comment: C-NOMO)  (masked out: inside a compile mask, not in the netlist)
C?#2  value 1nF  [C0402]  (hidden comment: C-NOMO)  (masked out: inside a compile mask, not in the netlist)
C?#3  value 1nF  [C0402]  (hidden comment: C-NOMO)  (masked out: inside a compile mask, not in the netlist)
C?#4  value 100nF  [C0402]  (hidden comment: C-NOMO)  (masked out: inside a compile mask, not in the netlist)
C?#5  value 1nF  [C0402]  (hidden comment: C-NOMO)  (masked out: inside a compile mask, not in the netlist)
C?#6  value 1nF  [C0402]  (hidden comment: C-NOMO)  (masked out: inside a compile mask, not in the netlist)
J5  GE-8  [RJ45-UP]  (value not drawn)
J?#1  DIFF  [HDR2X5-NJ]  (masked out: inside a compile mask, not in the netlist)
J?#2  TTL  [KF301-5.0-4P]  (masked out: inside a compile mask, not in the netlist)
J?#3  HDR1X6  [KF301-5.0-6P]  (value not drawn)  (masked out: inside a compile mask, not in the netlist)
R46  value 1K  [R0402]  (hidden comment: R)
R47  value 1K  [R0402]  (hidden comment: R)
R48  value 1K  [R0402]  (hidden comment: R)
R49  value 0  [R0402]  (hidden comment: R)
R50  value 0  [R0402]  (hidden comment: R)
R51  value 0  [R0402]  (hidden comment: R)
R52  value 1K  [R0402]  (hidden comment: R)
R53  value 1K  [R0402]  (hidden comment: R)
R54  value 1K  [R0402]  (hidden comment: R)
R?#1  value 1K  [R0402]  (hidden comment: R)  (masked out: inside a compile mask, not in the netlist)
R?#2  value 1K  [R0402]  (hidden comment: R)  (masked out: inside a compile mask, not in the netlist)
R?#3  value 1K  [R0402]  (hidden comment: R)  (masked out: inside a compile mask, not in the netlist)
R?#4  value 1K  [R0402]  (hidden comment: R)  (masked out: inside a compile mask, not in the netlist)
R?#5  value 1K  [R0402]  (hidden comment: R)  (masked out: inside a compile mask, not in the netlist)
R?#6  value 1K  [R0402]  (hidden comment: R)  (masked out: inside a compile mask, not in the netlist)
R?#7  value 2.4K  [R2512]  (hidden comment: R)  (masked out: inside a compile mask, not in the netlist)
R?#8  value 2.4K  [R2512]  (hidden comment: R)  (masked out: inside a compile mask, not in the netlist)
R?#9  value 2.4K  [R2512]  (hidden comment: R)  (masked out: inside a compile mask, not in the netlist)
R?#10  value 2.4K  [R2512]  (hidden comment: R)  (masked out: inside a compile mask, not in the netlist)
SH7  SHIELDSUPPORT  [SHIELDSUPPORT1]  (value not drawn)
SH8  SHIELDSUPPORT  [SHIELDSUPPORT1]  (value not drawn)
SH9  SHIELDSUPPORT  [SHIELDSUPPORT1]  (value not drawn)
SH10  SHIELDSUPPORT  [SHIELDSUPPORT1]  (value not drawn)
SH11  SHIELDSUPPORT  [SHIELDSUPPORT1]  (value not drawn)
SH12  SHIELDSUPPORT  [SHIELDSUPPORT1]  (value not drawn)
U5  DS90LV048ATM  [DS90LV048]
U?#1  TLP2168  [TLP2168]  (value not drawn)  (masked out: inside a compile mask, not in the netlist)
U?#2  TLP2168  [TLP2168]  (value not drawn)  (masked out: inside a compile mask, not in the netlist)
YTX?#1  YTX  [YTX]  (value not drawn)  (masked out: inside a compile mask, not in the netlist)
YTX?#2  YTX  [YTX]  (value not drawn)  (masked out: inside a compile mask, not in the netlist)
YTX?#3  YTX  [YTX]  (value not drawn)  (masked out: inside a compile mask, not in the netlist)
YTX?#4  YTX  [YTX]  (value not drawn)  (masked out: inside a compile mask, not in the netlist)
YTX?#5  YTX  [YTX]  (value not drawn)  (masked out: inside a compile mask, not in the netlist)
YTX?#6  YTX  [YTX]  (value not drawn)  (masked out: inside a compile mask, not in the netlist)
YTX?#7  YTX  [YTX]  (value not drawn)  (masked out: inside a compile mask, not in the netlist)
YTX?#8  YTX  [YTX]  (value not drawn)  (masked out: inside a compile mask, not in the netlist)
YTX?#9  YTX  [YTX]  (value not drawn)  (masked out: inside a compile mask, not in the netlist)
YTX?#10  YTX  [YTX]  (value not drawn)  (masked out: inside a compile mask, not in the netlist)
YTX?#11  YTX  [YTX]  (value not drawn)  (masked out: inside a compile mask, not in the netlist)
YTX?#12  YTX  [YTX]  (value not drawn)  (masked out: inside a compile mask, not in the netlist)

### Blocks framed on the sheet
Diff interface: C42-C44 J5 J?#1 R46-R54 SH7-SH12 U5 YTX?#1-YTX?#6
TTL interface: J?#2 R?#1-R?#3 YTX?#7-YTX?#9
PLC interface: C?#1-C?#6 J?#3 R?#4-R?#10 U?#1 U?#2 YTX?#10-YTX?#12

### Ports
SKUN (bidir, harness SKUN)

### Harnesses
SKUN: SDATA, SCLK, SEN

### Nets
DGND: C42.1 C43.1 C44.1 J5.SH1 J5.SH2 SH7.SH SH8.SH SH9.SH SH10.SH SH11.SH SH12.SH U5.9(EN*) U5.12(GND)
VCC3.3: C42.2 C43.2 C44.2 R46.2 R47.2 R48.2 U5.13(VCC) U5.16(EN)
SCLK: R50.1 ; port SKUN.SCLK
SCLK_N: J5.6 R53.1 U5.4(Rin2-)
SCLK_P: J5.3 R53.2 U5.3(Rin2+)
SDATA: R51.1 ; port SKUN.SDATA
SDATA_N: J5.2 R52.1 U5.5(Rin3-)
SDATA_P: J5.1 R52.2 U5.6(Rin3+)
SEN: R49.1 ; port SKUN.SEN
SEN_N: J5.5 R54.1 U5.1(Rin1-)
SEN_P: J5.4 R54.2 U5.2(Rin1+)
NetR46_1: R46.1 R49.2 U5.15(Rout1)
NetR47_1: R47.1 R50.2 U5.14(Rout2)
NetR48_1: R48.1 R51.2 U5.11(Rout3)

Not connected (* = marked no-connect by the designer): J5 7* 8*; U5 7(Rin4+)* 8(Rin4-)* 10(Rout4)*

### Layout directives
differential pair; differential pair class MY_DIFF: SCLK_N, SCLK_P, SDATA_N, SDATA_P, SEN_N, SEN_P

### Notes on the sheet
- SKUN Bus

### Library data of the parts
C42-C44 C?#1-C?#6 = C-NOMO: voltage: 25V; precision: 5%
J5 = RJ45-UP
J?#1 = HDR2X5
J?#2 = HDR1X4
R46-R54 R?#1-R?#10 = R: precision: 1%

## Sheet VALVEBOARD_DigitalPower.SchDoc
size A4; SheetNumber: 3; SheetTotal: 9
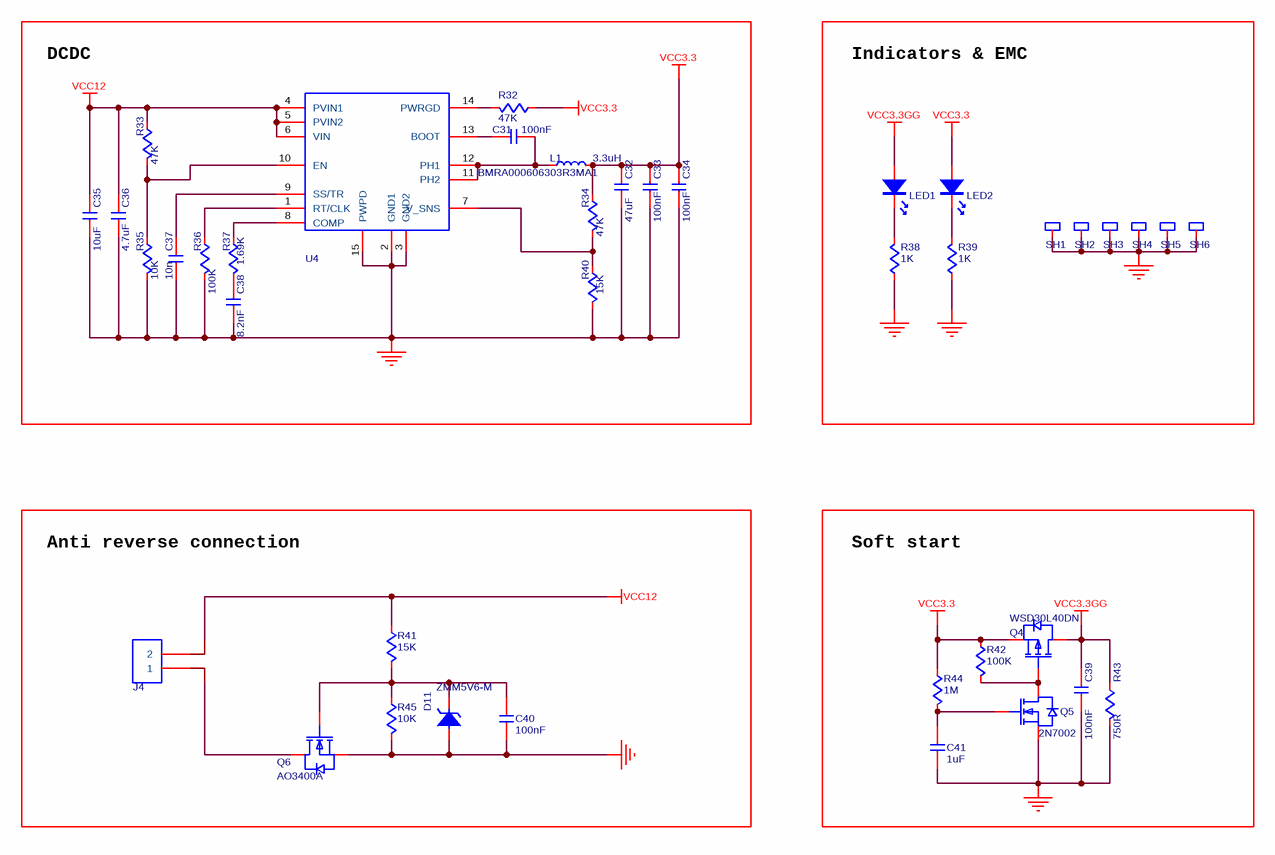
[diagram p7: VALVEBOARD_DigitalPower.SchDoc]

### Parts
C31  value 100nF  [C0402]  (hidden comment: C-NOMO)
C32  value 47uF  [C0805]  (hidden comment: C-NOMO)
C33  value 100nF  [C0402]  (hidden comment: C-NOMO)
C34  value 100nF  [C0402]  (hidden comment: C-NOMO)
C35  value 10uF  [C0805]  (hidden comment: C-NOMO)
C36  value 4.7uF  [C0805]  (hidden comment: C-NOMO)
C37  value 10n  [C0402]  (hidden comment: C-NOMO)
C38  value 8.2nF  [C0402]  (hidden comment: C-NOMO)
C39  value 100nF  [C0402]  (hidden comment: C-NOMO)
C40  value 100nF  [C0402]  (hidden comment: C-NOMO)
C41  value 1uF  [C0603]  (hidden comment: C-NOMO)
D11  ZMM5V6-M  [ZMM5V6-M]
J4  HDR1X2  [KF301-5.0-2P]  (value not drawn)
L1  BMRA000606303R3MA1  value 3.3uH  [FXL0624]
LED1  LED  [LED0603]  (value not drawn)
LED2  LED  [LED0603]  (value not drawn)
Q4  WSD30L40DN  [WSD30L40DN]
Q5  2N7002  [2N7002]
Q6  AO3400A  [AO3400A]
R32  value 47K  [R0402]  (hidden comment: R)
R33  value 47K  [R0402]  (hidden comment: R)
R34  value 47K  [R0402]  (hidden comment: R)
R35  value 10K  [R0402]  (hidden comment: R)
R36  value 100K  [R0402]  (hidden comment: R)
R37  value 1.69K  [R0402]  (hidden comment: R)
R38  value 1K  [R0402]  (hidden comment: R)
R39  value 1K  [R0402]  (hidden comment: R)
R40  value 15K  [R0402]  (hidden comment: R)
R41  value 15K  [R0402]  (hidden comment: R)
R42  value 100K  [R0402]  (hidden comment: R)
R43  value 750R  [R0805]  (hidden comment: R)
R44  value 1M  [R0402]  (hidden comment: R)
R45  value 10K  [R0402]  (hidden comment: R)
SH1  SHIELDSUPPORT  [SHIELDSUPPORT1]  (value not drawn)
SH2  SHIELDSUPPORT  [SHIELDSUPPORT1]  (value not drawn)
SH3  SHIELDSUPPORT  [SHIELDSUPPORT1]  (value not drawn)
SH4  SHIELDSUPPORT  [SHIELDSUPPORT1]  (value not drawn)
SH5  SHIELDSUPPORT  [SHIELDSUPPORT1]  (value not drawn)
SH6  SHIELDSUPPORT  [SHIELDSUPPORT1]  (value not drawn)
U4  TPS54620  [TPS54620]  (value not drawn)

### Blocks framed on the sheet
DCDC: C31-C38 L1 R32-R37 R40 U4
Indicators & EMC: LED1 LED2 R38 R39 SH1-SH6
Anti reverse connection: C40 D11 J4 Q6 R41 R45
Soft start: C39 C41 Q4 Q5 R42-R44

### Nets
DGND: C32.1 C33.1 C34.1 C35.1 C36.1 C37.1 C38.1 C39.1 C40.1 C41.1 D11.2 Q5.S Q6.S R35.1 R36.1 R38.2 R39.2 R40.1 R43.1 R45.1 SH1.SH SH2.SH SH3.SH SH4.SH SH5.SH SH6.SH U4.2(GND1) U4.3(GND2) U4.15(PWPD)
VCC3.3: C32.2 C33.2 C34.2 L1.2 LED2.2 Q4.S R32.2 R34.2 R42.2 R44.2
VCC3.3GG: C39.2 LED1.2 Q4.D R43.2
VCC12: C35.2 C36.2 J4.2 R33.2 R41.2 U4.4(PVIN1) U4.5(PVIN2) U4.6(VIN)
NetC31_1: C31.1 U4.13(BOOT)
NetC31_2: C31.2 L1.1 U4.11(PH2) U4.12(PH1)
NetC37_2: C37.2 U4.9(SS/TR)
NetC38_2: C38.2 R37.1
NetC40_2: C40.2 D11.1 Q6.G R41.1 R45.2
NetC41_2: C41.2 Q5.G R44.1
NetJ4_1: J4.1 Q6.D
NetLED1_1: LED1.1 R38.1
NetLED2_1: LED2.1 R39.1
NetQ4_G: Q4.G Q5.D R42.1
NetR32_1: R32.1 U4.14(PWRGD)
NetR33_1: R33.1 R35.2 U4.10(EN)
NetR34_1: R34.1 R40.2 U4.7(V_SNS)
NetR36_2: R36.2 U4.1(RT/CLK)
NetR37_2: R37.2 U4.8(COMP)

### Library data of the parts
C31-C41 = C-NOMO: voltage: 25V; precision: 5%
L1 = L: Code_IEC: 1005; Published: 8-Jun-2000; LatestRevisionDate: 29-May-2009; LatestRevisionNote: IPC-7351 Footprint Added.; PackageReference: 0402-A; Publisher: Altium Limited; PackageDescription: Chip Inductor; Code_JEITA: 0402
R32-R45 = R: precision: 1%
D11 = ZMM5V6-M: Supplier 1: LCSC; Supplier Part Number 1: C8062
Q4 = WSD30L40DN: Supplier 1: LCSC; Supplier Part Number 1: C148390
Q5 = 2N7002: Supplier 1: LCSC; Supplier Part Number 1: C8545
Q6 = AO3400A: Supplier 1: LCSC; Supplier Part Number 1: C20917